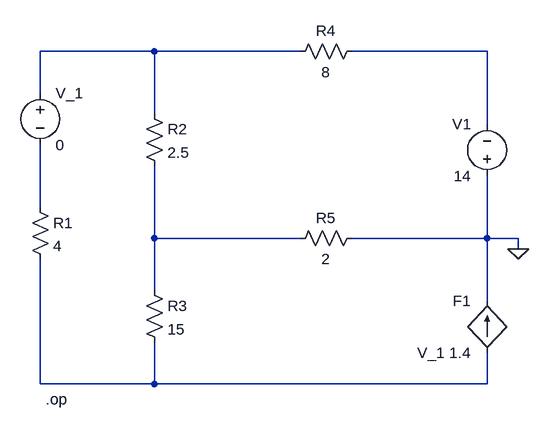
[diagram p0: schematic CH03-KP1-05.asc]
CH03-KP1-05.asc, the LTspice schematic file:
Version 4
SHEET 1 880 680
WIRE 192 64 16 64
WIRE 416 64 192 64
WIRE 704 64 496 64
WIRE 16 128 16 64
WIRE 192 160 192 64
WIRE 704 176 704 64
WIRE 16 304 16 208
WIRE 192 352 192 240
WIRE 416 352 192 352
WIRE 704 352 704 256
WIRE 704 352 496 352
WIRE 752 352 704 352
WIRE 752 368 752 352
WIRE 192 432 192 352
WIRE 704 448 704 352
WIRE 16 576 16 384
WIRE 192 576 192 512
WIRE 192 576 16 576
WIRE 704 576 704 528
WIRE 704 576 192 576
FLAG 752 368 0
DATAFLAG 704 576 "$"
SYMBOL res 0 288 R0
SYMATTR InstName R1
SYMATTR Value 4
SYMBOL res 176 144 R0
SYMATTR InstName R2
SYMATTR Value 2.5
SYMBOL res 176 416 R0
SYMATTR InstName R3
SYMATTR Value 15
SYMBOL res 512 48 R90
WINDOW 0 0 56 VBottom 2
WINDOW 3 32 56 VTop 2
SYMATTR InstName R4
SYMATTR Value 8
SYMBOL res 512 336 R90
WINDOW 0 0 56 VBottom 2
WINDOW 3 32 56 VTop 2
SYMATTR InstName R5
SYMATTR Value 2
SYMBOL voltage 704 272 R180
WINDOW 0 24 96 Left 2
WINDOW 3 24 16 Left 2
SYMATTR InstName V1
SYMATTR Value 14
SYMBOL f 704 528 R180
WINDOW 0 24 80 Left 2
WINDOW 3 24 0 Left 2
SYMATTR InstName F1
SYMATTR Value V_1 1.4
SYMBOL voltage 16 112 R0
SYMATTR InstName V_1
SYMATTR Value 0
TEXT 24 600 Left 2 !.op

The netlist it stands for:
* CH03-KP1-05.asc
R1 N003 N005 4
R2 N001 N004 2.5
R3 N004 N005 15
R4 N002 N001 8
R5 0 N004 2
V1 0 N002 14
F1 N005 0 V_1 1.4
V_1 N001 N003 0
.op
.backanno
.end